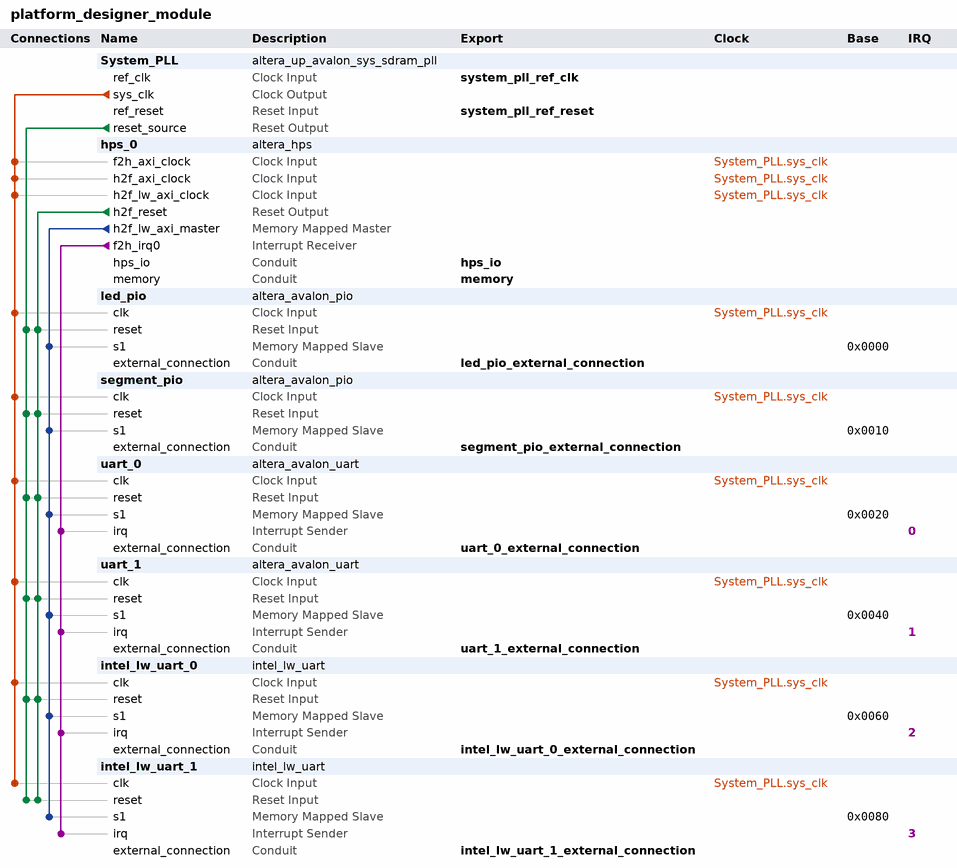
[diagram p0: system contents]
# Platform Designer (Qsys) system platform_designer_module, Cyclone V 5CSEMA5F31C6
# Parameters at their usual value, and those the tool derives, are not listed.
package require -exact qsys 25.1
create_system platform_designer_module
set_project_property DEVICE_FAMILY {Cyclone V}
set_project_property DEVICE 5CSEMA5F31C6

add_instance System_PLL altera_up_avalon_sys_sdram_pll 18.0
set_instance_parameter_value System_PLL CV_boards DE1-SoC
set_instance_parameter_value System_PLL gui_outclk 50.0
set_instance_parameter_value System_PLL gui_refclk 50.0

add_instance hps_0 altera_hps 25.1
set_instance_parameter_value hps_0 EMAC1_Mode RGMII
set_instance_parameter_value hps_0 EMAC1_PinMuxing {HPS I/O Set 0}
set_instance_parameter_value hps_0 F2SCLK_COLDRST_Enable false
set_instance_parameter_value hps_0 F2SCLK_DBGRST_Enable false
set_instance_parameter_value hps_0 F2SCLK_WARMRST_Enable false
set_instance_parameter_value hps_0 F2SINTERRUPT_Enable true
set_instance_parameter_value hps_0 F2S_Width 2
set_instance_parameter_value hps_0 FPGA_PERIPHERAL_OUTPUT_CLOCK_FREQ_EMAC0_GTX_CLK 125
set_instance_parameter_value hps_0 FPGA_PERIPHERAL_OUTPUT_CLOCK_FREQ_EMAC0_MD_CLK 2.5
set_instance_parameter_value hps_0 FPGA_PERIPHERAL_OUTPUT_CLOCK_FREQ_EMAC1_GTX_CLK 125
set_instance_parameter_value hps_0 FPGA_PERIPHERAL_OUTPUT_CLOCK_FREQ_EMAC1_MD_CLK 2.5
set_instance_parameter_value hps_0 HPS_PROTOCOL DDR3
set_instance_parameter_value hps_0 I2C0_Mode I2C
set_instance_parameter_value hps_0 I2C0_PinMuxing {HPS I/O Set 0}
set_instance_parameter_value hps_0 I2C1_Mode I2C
set_instance_parameter_value hps_0 I2C1_PinMuxing {HPS I/O Set 0}
set_instance_parameter_value hps_0 LWH2F_Enable true
set_instance_parameter_value hps_0 MEM_BANKADDR_WIDTH 3
set_instance_parameter_value hps_0 MEM_CLK_FREQ 400.0
set_instance_parameter_value hps_0 MEM_COL_ADDR_WIDTH 10
set_instance_parameter_value hps_0 MEM_DQ_WIDTH 32
set_instance_parameter_value hps_0 MEM_DRV_STR RZQ/7
set_instance_parameter_value hps_0 MEM_ROW_ADDR_WIDTH 15
set_instance_parameter_value hps_0 MEM_RTT_NOM RZQ/4
set_instance_parameter_value hps_0 MEM_RTT_WR RZQ/4
set_instance_parameter_value hps_0 MEM_TCL 11
set_instance_parameter_value hps_0 MEM_TFAW_NS 30.0
set_instance_parameter_value hps_0 MEM_TRAS_NS 35.0
set_instance_parameter_value hps_0 MEM_TRCD_NS 13.75
set_instance_parameter_value hps_0 MEM_TRFC_NS 260.0
set_instance_parameter_value hps_0 MEM_TRP_NS 13.75
set_instance_parameter_value hps_0 MEM_VENDOR JEDEC
set_instance_parameter_value hps_0 MEM_WTCL 8
set_instance_parameter_value hps_0 QSPI_Mode {1 SS}
set_instance_parameter_value hps_0 QSPI_PinMuxing {HPS I/O Set 0}
set_instance_parameter_value hps_0 REF_CLK_FREQ 25.0
set_instance_parameter_value hps_0 S2FCLK_USER2CLK 5
set_instance_parameter_value hps_0 S2F_Width 3
set_instance_parameter_value hps_0 SDIO_Mode {4-bit Data}
set_instance_parameter_value hps_0 SDIO_PinMuxing {HPS I/O Set 0}
set_instance_parameter_value hps_0 SPIM1_Mode {Single Slave Select}
set_instance_parameter_value hps_0 SPIM1_PinMuxing {HPS I/O Set 0}
set_instance_parameter_value hps_0 STM_Enable false
set_instance_parameter_value hps_0 TIMING_BOARD_AC_SKEW 0.03
set_instance_parameter_value hps_0 TIMING_BOARD_AC_TO_CK_SKEW 0.0
set_instance_parameter_value hps_0 TIMING_BOARD_DQ_TO_DQS_SKEW 0.0
set_instance_parameter_value hps_0 TIMING_BOARD_MAX_CK_DELAY 0.03
set_instance_parameter_value hps_0 TIMING_BOARD_MAX_DQS_DELAY 0.02
set_instance_parameter_value hps_0 TIMING_BOARD_SKEW_BETWEEN_DQS 0.08
set_instance_parameter_value hps_0 TIMING_BOARD_SKEW_CKDQS_DIMM_MAX 0.16
set_instance_parameter_value hps_0 TIMING_BOARD_SKEW_CKDQS_DIMM_MIN 0.09
set_instance_parameter_value hps_0 TIMING_BOARD_SKEW_WITHIN_DQS 0.01
set_instance_parameter_value hps_0 TIMING_TDH 65
set_instance_parameter_value hps_0 TIMING_TDQSCK 255
set_instance_parameter_value hps_0 TIMING_TDQSQ 125
set_instance_parameter_value hps_0 TIMING_TDS 30
set_instance_parameter_value hps_0 TIMING_TIH 140
set_instance_parameter_value hps_0 TIMING_TIS 180
set_instance_parameter_value hps_0 TIMING_TQSH 0.4
set_instance_parameter_value hps_0 UART0_Mode {No Flow Control}
set_instance_parameter_value hps_0 UART0_PinMuxing {HPS I/O Set 0}
set_instance_parameter_value hps_0 USB1_Mode SDR
set_instance_parameter_value hps_0 USB1_PinMuxing {HPS I/O Set 0}
set_instance_parameter_value hps_0 desired_cfg_clk_mhz 100.0
set_instance_parameter_value hps_0 desired_qspi_clk_mhz 400.0

add_instance led_pio altera_avalon_pio 25.1
set_instance_parameter_value led_pio direction InOut
set_instance_parameter_value led_pio width 10

add_instance segment_pio altera_avalon_pio 25.1
set_instance_parameter_value segment_pio direction InOut
set_instance_parameter_value segment_pio width 10

add_instance uart_0 altera_avalon_uart 25.1
set_instance_parameter_value uart_0 baud 115200
set_instance_parameter_value uart_0 dataBits 8
set_instance_parameter_value uart_0 fixedBaud true
set_instance_parameter_value uart_0 parity NONE
set_instance_parameter_value uart_0 stopBits 1

add_instance uart_1 altera_avalon_uart 25.1
set_instance_parameter_value uart_1 baud 115200
set_instance_parameter_value uart_1 dataBits 8
set_instance_parameter_value uart_1 fixedBaud true
set_instance_parameter_value uart_1 parity NONE
set_instance_parameter_value uart_1 stopBits 1

add_instance intel_lw_uart_0 intel_lw_uart 25.1
set_instance_parameter_value intel_lw_uart_0 baud 115200
set_instance_parameter_value intel_lw_uart_0 dataBits 8
set_instance_parameter_value intel_lw_uart_0 fixedBaud true
set_instance_parameter_value intel_lw_uart_0 parity NONE
set_instance_parameter_value intel_lw_uart_0 rxfifoAlmostFullValue 1
set_instance_parameter_value intel_lw_uart_0 rxfifoDepth 8
set_instance_parameter_value intel_lw_uart_0 simTrueBaud false
set_instance_parameter_value intel_lw_uart_0 stopBits 1
set_instance_parameter_value intel_lw_uart_0 syncRegDepth 2
set_instance_parameter_value intel_lw_uart_0 txfifoDepth 8
set_instance_parameter_value intel_lw_uart_0 useCtsRts false
set_instance_parameter_value intel_lw_uart_0 useEopRegister false
set_instance_parameter_value intel_lw_uart_0 useRegRXFIFO false
set_instance_parameter_value intel_lw_uart_0 useRegTXFIFO false

add_instance intel_lw_uart_1 intel_lw_uart 25.1
set_instance_parameter_value intel_lw_uart_1 baud 115200
set_instance_parameter_value intel_lw_uart_1 dataBits 8
set_instance_parameter_value intel_lw_uart_1 fixedBaud true
set_instance_parameter_value intel_lw_uart_1 parity NONE
set_instance_parameter_value intel_lw_uart_1 rxfifoAlmostFullValue 1
set_instance_parameter_value intel_lw_uart_1 rxfifoDepth 8
set_instance_parameter_value intel_lw_uart_1 simTrueBaud false
set_instance_parameter_value intel_lw_uart_1 stopBits 1
set_instance_parameter_value intel_lw_uart_1 syncRegDepth 2
set_instance_parameter_value intel_lw_uart_1 txfifoDepth 8
set_instance_parameter_value intel_lw_uart_1 useCtsRts false
set_instance_parameter_value intel_lw_uart_1 useEopRegister false
set_instance_parameter_value intel_lw_uart_1 useRegRXFIFO false
set_instance_parameter_value intel_lw_uart_1 useRegTXFIFO false

# connections
add_connection System_PLL.sys_clk hps_0.f2h_axi_clock clock
add_connection System_PLL.sys_clk hps_0.h2f_axi_clock clock
add_connection System_PLL.sys_clk hps_0.h2f_lw_axi_clock clock
add_connection System_PLL.sys_clk intel_lw_uart_0.clk clock
add_connection System_PLL.sys_clk intel_lw_uart_1.clk clock
add_connection System_PLL.sys_clk led_pio.clk clock
add_connection System_PLL.sys_clk segment_pio.clk clock
add_connection System_PLL.sys_clk uart_0.clk clock
add_connection System_PLL.sys_clk uart_1.clk clock
add_connection hps_0.h2f_reset intel_lw_uart_0.reset reset
add_connection hps_0.h2f_reset intel_lw_uart_1.reset reset
add_connection hps_0.h2f_reset led_pio.reset reset
add_connection hps_0.h2f_reset segment_pio.reset reset
add_connection hps_0.h2f_reset uart_0.reset reset
add_connection hps_0.h2f_reset uart_1.reset reset
add_connection System_PLL.reset_source intel_lw_uart_0.reset reset
add_connection System_PLL.reset_source intel_lw_uart_1.reset reset
add_connection System_PLL.reset_source led_pio.reset reset
add_connection System_PLL.reset_source segment_pio.reset reset
add_connection System_PLL.reset_source uart_0.reset reset
add_connection System_PLL.reset_source uart_1.reset reset
add_connection hps_0.h2f_lw_axi_master intel_lw_uart_0.s1 avalon
set_connection_parameter_value hps_0.h2f_lw_axi_master/intel_lw_uart_0.s1 baseAddress 0x0060
add_connection hps_0.h2f_lw_axi_master intel_lw_uart_1.s1 avalon
set_connection_parameter_value hps_0.h2f_lw_axi_master/intel_lw_uart_1.s1 baseAddress 0x0080
add_connection hps_0.h2f_lw_axi_master led_pio.s1 avalon
set_connection_parameter_value hps_0.h2f_lw_axi_master/led_pio.s1 baseAddress 0x0000
add_connection hps_0.h2f_lw_axi_master segment_pio.s1 avalon
set_connection_parameter_value hps_0.h2f_lw_axi_master/segment_pio.s1 baseAddress 0x0010
add_connection hps_0.h2f_lw_axi_master uart_0.s1 avalon
set_connection_parameter_value hps_0.h2f_lw_axi_master/uart_0.s1 baseAddress 0x0020
add_connection hps_0.h2f_lw_axi_master uart_1.s1 avalon
set_connection_parameter_value hps_0.h2f_lw_axi_master/uart_1.s1 baseAddress 0x0040
add_connection hps_0.f2h_irq0 intel_lw_uart_0.irq interrupt
set_connection_parameter_value hps_0.f2h_irq0/intel_lw_uart_0.irq irqNumber 2
add_connection hps_0.f2h_irq0 intel_lw_uart_1.irq interrupt
set_connection_parameter_value hps_0.f2h_irq0/intel_lw_uart_1.irq irqNumber 3
add_connection hps_0.f2h_irq0 uart_0.irq interrupt
set_connection_parameter_value hps_0.f2h_irq0/uart_0.irq irqNumber 0
add_connection hps_0.f2h_irq0 uart_1.irq interrupt
set_connection_parameter_value hps_0.f2h_irq0/uart_1.irq irqNumber 1

# exported interfaces
add_interface hps_io conduit end
set_interface_property hps_io EXPORT_OF hps_0.hps_io
add_interface intel_lw_uart_0_external_connection conduit end
set_interface_property intel_lw_uart_0_external_connection EXPORT_OF intel_lw_uart_0.external_connection
add_interface intel_lw_uart_1_external_connection conduit end
set_interface_property intel_lw_uart_1_external_connection EXPORT_OF intel_lw_uart_1.external_connection
add_interface led_pio_external_connection conduit end
set_interface_property led_pio_external_connection EXPORT_OF led_pio.external_connection
add_interface memory conduit end
set_interface_property memory EXPORT_OF hps_0.memory
add_interface segment_pio_external_connection conduit end
set_interface_property segment_pio_external_connection EXPORT_OF segment_pio.external_connection
add_interface system_pll_ref_clk clock sink
set_interface_property system_pll_ref_clk EXPORT_OF System_PLL.ref_clk
add_interface system_pll_ref_reset reset sink
set_interface_property system_pll_ref_reset EXPORT_OF System_PLL.ref_reset
add_interface uart_0_external_connection conduit end
set_interface_property uart_0_external_connection EXPORT_OF uart_0.external_connection
add_interface uart_1_external_connection conduit end
set_interface_property uart_1_external_connection EXPORT_OF uart_1.external_connection

set_interconnect_requirement {$system} qsys_mm.clockCrossingAdapter HANDSHAKE
set_interconnect_requirement {$system} qsys_mm.enableEccProtection FALSE
set_interconnect_requirement {$system} qsys_mm.insertDefaultSlave FALSE
set_interconnect_requirement {$system} qsys_mm.maxAdditionalLatency 1

save_system platform_designer_module.qsys
